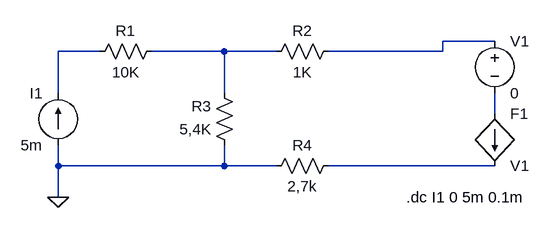
[diagram p0: schematic t4.asc]
t4.asc, the LTspice schematic file:
Version 4
SHEET 1 880 680
WIRE 688 64 608 64
WIRE 80 80 16 80
WIRE 272 80 160 80
WIRE 352 80 272 80
WIRE 608 80 608 64
WIRE 608 80 432 80
WIRE 16 144 16 80
WIRE 272 144 272 80
WIRE 688 176 688 144
WIRE 16 256 16 224
WIRE 272 256 272 224
WIRE 272 256 16 256
WIRE 352 256 272 256
WIRE 688 256 432 256
WIRE 16 304 16 256
FLAG 16 304 0
SYMBOL res 176 64 R90
WINDOW 0 0 56 VBottom 2
WINDOW 3 32 56 VTop 2
SYMATTR InstName R1
SYMATTR Value 10K
SYMBOL res 448 64 R90
WINDOW 0 0 56 VBottom 2
WINDOW 3 32 56 VTop 2
SYMATTR InstName R2
SYMATTR Value 1K
SYMBOL res 288 240 R180
WINDOW 0 36 76 Left 2
WINDOW 3 36 40 Left 2
SYMATTR InstName R3
SYMATTR Value 5,4K
SYMBOL res 336 272 R270
WINDOW 0 32 56 VTop 2
WINDOW 3 0 56 VBottom 2
SYMATTR InstName R4
SYMATTR Value 2,7k
SYMBOL current 16 224 R180
WINDOW 0 24 80 Left 2
WINDOW 3 24 0 Left 2
WINDOW 123 0 0 Left 2
WINDOW 39 0 0 Left 2
SYMATTR InstName I1
SYMATTR Value 5m
SYMBOL voltage 688 48 R0
WINDOW 123 0 0 Left 2
WINDOW 39 0 0 Left 2
SYMATTR InstName V1
SYMATTR Value 0
SYMBOL f 688 176 R0
SYMATTR InstName F1
SYMATTR Value V1
SYMATTR Value2 40
TEXT 552 304 Left 2 !.dc I1 0 5m 0.1m

The netlist it stands for:
* t4.asc
R1 N003 N002 10K
R2 N001 N003 1K
R3 0 N003 5,4K
R4 0 N005 2,7k
I1 0 N002 5m
V1 N001 N004 0
F1 N004 N005 V1 40
.dc I1 0 5m 0.1m
.backanno
.end